# Altium project ESP32_CAM.PrjPcb
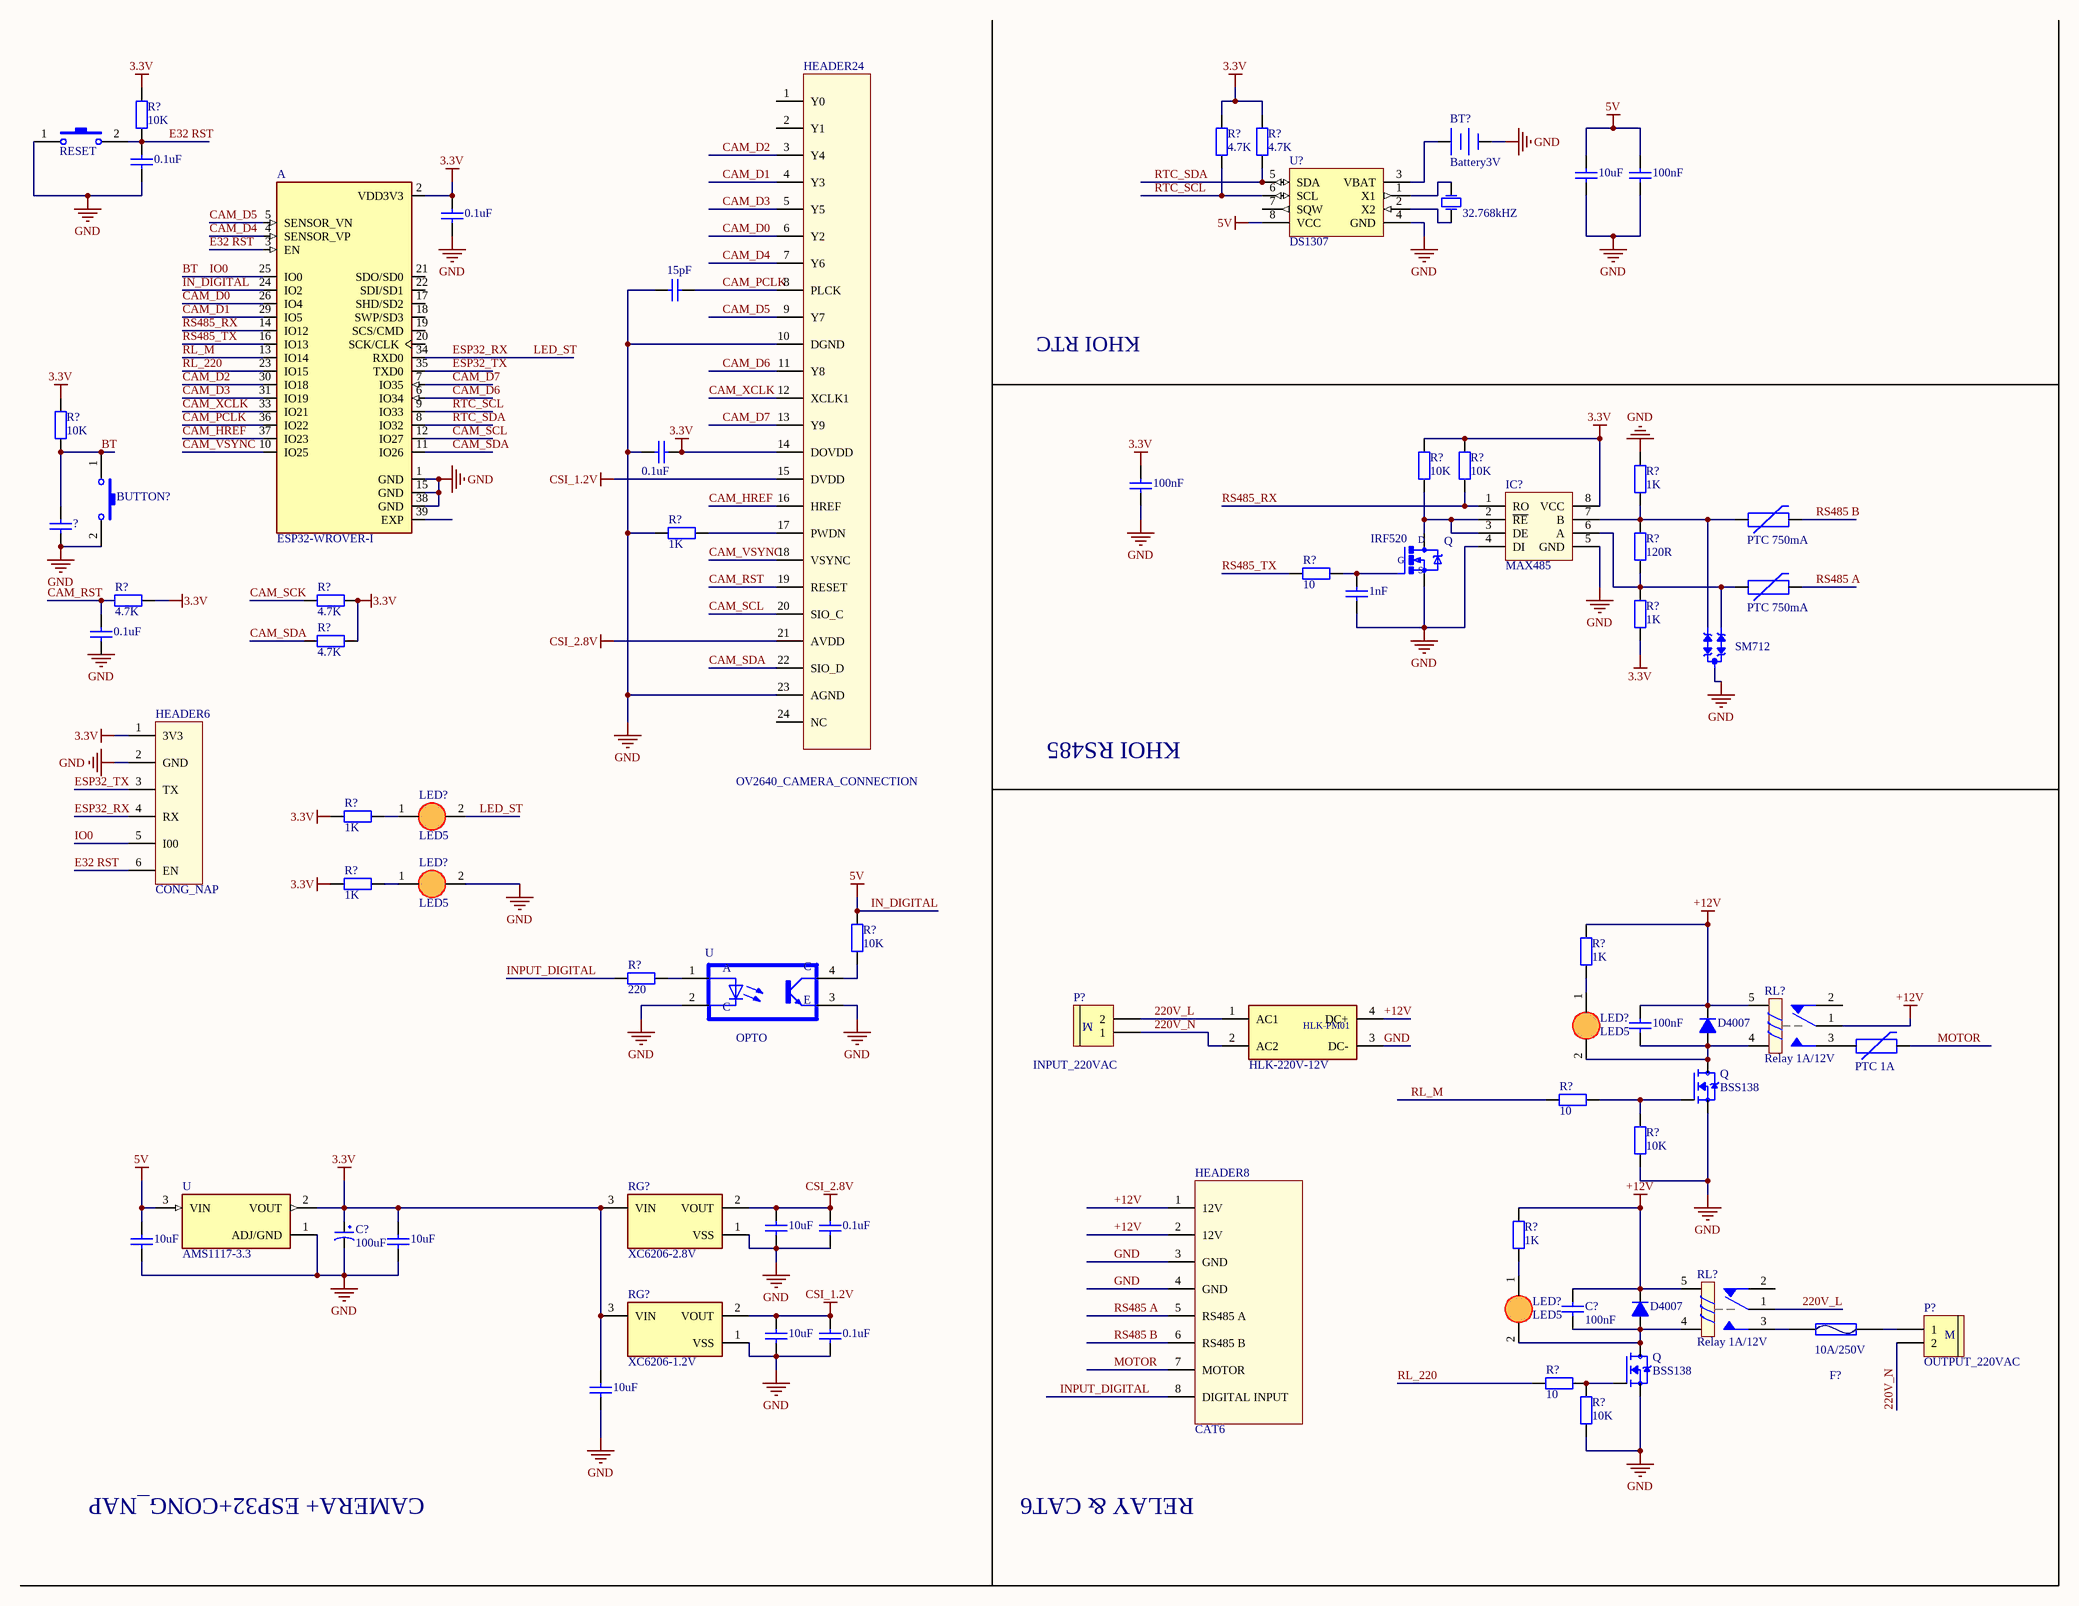
[diagram p0: Sheet1.SchDoc]
1 sheet, 77 parts. Net scope: global (net labels, ports and power ports of the same name join across sheets).
Board file: PCB1.PcbDoc

## Sheet Sheet1.SchDoc
size A0

### Parts
(Parts that share a designator on the sheet are numbered #1, #2 ... from top to bottom, then left to right.)
0.1uF#1  Capacitor Ceramic  [C0805]  (value not drawn)
0.1uF#2  Capacitor Ceramic  [C0805]  (value not drawn)
0.1uF#3  Capacitor Ceramic  [C0805]  (value not drawn)
0.1uF#4  Capacitor Ceramic  [C0805]  (value not drawn)
0.1uF#5  Capacitor Ceramic  [C0805]  (value not drawn)
0.1uF#6  Capacitor Ceramic  [C0805]  (value not drawn)
1nF  Capacitor Ceramic  [C0805]  (value not drawn)
10uF#1  Capacitor Ceramic  [C0805]  (value not drawn)
10uF#2  Capacitor Ceramic  [C0805]  (value not drawn)
10uF#3  Capacitor Ceramic  [C0805]  (value not drawn)
10uF#4  Capacitor Ceramic  [C0805]  (value not drawn)
10uF#5  Capacitor Ceramic  [C0805]  (value not drawn)
10uF#6  Capacitor Ceramic  [C0805]  (value not drawn)
15pF  Capacitor Ceramic  [C0805]  (value not drawn)
100nF#1  Capacitor Ceramic  [C0805]  (value not drawn)
100nF#2  Capacitor Ceramic  [C0805]  (value not drawn)
100nF#3  Capacitor Ceramic  [C0805]  (value not drawn)
?#1  PTC 750mA  [MC331XX]
?#2  Capacitor Ceramic  [C0805]  (value not drawn)
?#3  PTC 750mA  [MC331XX]
?#4  SM712  [SOT23-3]
?#5  HLK-220V-12V  [HLK 220-12]
?#6  PTC 1A  [MC331XX]
A  ESP32-WROVER-I  [XCVR_ESP32-WROVER-I]
BT?  Battery3V  [HDR1X2]
BUTTON?  SW-2P-S  [SW-2P-S]  (value not drawn)
C?#1  100uF  [CP1.5/3.4]
C?#2  100nF  [C1206]
D4007#1  1N4007  [D1A]  (value not drawn)
D4007#2  1N4007  [D1A]  (value not drawn)
F?  10A/250V  [Fuse]
HEADER6  CONG_NAP  [CONG_NAP]
HEADER8  CAT6  [CAT6_3.5mm]
HEADER24  OV2640_CAMERA_CONNECTION  [OV2640_0.5mm]
IC?  MAX485  [SO-8]
LED?#1  LED5  [LED5MM]
LED?#2  LED5  [LED5MM]
LED?#3  LED5  [LED5MM]
LED?#4  LED5  [LED5MM]
P?#1  INPUT_220VAC  [Medium - Header 2]
P?#2  OUTPUT_220VAC  [Medium - Header 2]
Q#1  IRF520  [TO220BV]
Q#2  BSS138  [SOT95P240X111-3N]
Q#3  BSS138  [SOT95P240X111-3N]
R?#1  value 10K  [DIEN TRO 0805]  (hidden comment: RES_08)
R?#2  value 4.7K  [DIEN TRO 0805]  (hidden comment: RES_08)
R?#3  value 4.7K  [DIEN TRO 0805]  (hidden comment: RES_08)
R?#4  value 10K  [DIEN TRO 0805]  (hidden comment: RES_08)
R?#5  value 10K  [DIEN TRO 0805]  (hidden comment: RES_08)
R?#6  value 10K  [DIEN TRO 0805]  (hidden comment: RES_08)
R?#7  value 1K  [DIEN TRO 0805]  (hidden comment: RES_08)
R?#8  value 1K  [DIEN TRO 0805]  (hidden comment: RES_08)
R?#9  value 120R  [DIEN TRO 0805]  (hidden comment: RES_08)
R?#10  value 10  [DIEN TRO 0805]  (hidden comment: RES_08)
R?#11  value 4.7K  [DIEN TRO 0805]  (hidden comment: RES_08)
R?#12  value 4.7K  [DIEN TRO 0805]  (hidden comment: RES_08)
R?#13  value 1K  [DIEN TRO 0805]  (hidden comment: RES_08)
R?#14  value 4.7K  [DIEN TRO 0805]  (hidden comment: RES_08)
R?#15  value 1K  [DIEN TRO 0805]  (hidden comment: RES_08)
R?#16  value 1K  [DIEN TRO 0805]  (hidden comment: RES_08)
R?#17  value 10K  [DIEN TRO 0805]  (hidden comment: RES_08)
R?#18  value 1K  [DIEN TRO 0805]  (hidden comment: RES_08)
R?#19  value 220  [DIEN TRO 0805]  (hidden comment: RES_08)
R?#20  value 10  [DIEN TRO 0805]  (hidden comment: RES_08)
R?#21  value 10K  [DIEN TRO 0805]  (hidden comment: RES_08)
R?#22  value 1K  [DIEN TRO 0805]  (hidden comment: RES_08)
R?#23  value 10  [DIEN TRO 0805]  (hidden comment: RES_08)
R?#24  value 10K  [DIEN TRO 0805]  (hidden comment: RES_08)
RESET  SW-2P-S  [SW-2P-S]  (value not drawn)
RG?#1  Part Number: XC6206-2.8V  [Torex_https--www.torexsemi.com-file-SOT-23-SOT-23-pkg.pdf_0]  (hidden comment: Reg_Torex_XC6206P332MR_eec)
RG?#2  Part Number: XC6206-1.2V  [Torex_https--www.torexsemi.com-file-SOT-23-SOT-23-pkg.pdf_0]  (hidden comment: Reg_Torex_XC6206P332MR_eec)
RL?#1  Relay 1A/12V  [RL_SPDT_10A]
RL?#2  Relay 1A/12V  [RL_SPDT_10A]
U#1  OPTO  [SOIC254P1016X390-4N]
U#2  AMS1117-3.3  [SOT229P700X180-4N]
U?  DS1307  [SOIC8]
Y?  32.768kHZ  [XTAL]

### Nets
3.3V: 0.1uF#2.2 0.1uF#3.1 10uF#4.2 10uF#6.2 100nF#2.2 A.2(VDD3V3) C?#1.1 HEADER6.1(3V3) HEADER24.14(DOVDD) IC?.8(VCC) R?#1.2 R?#2.1 R?#3.1 R?#4.1 R?#5.1 R?#6.1 R?#11.1 R?#12.1 R?#13.2 R?#14.1 R?#15.2 R?#16.2 RG?#1.3(VIN) RG?#2.3(VIN) U#2.2(VOUT)
+12V: 100nF#3.2 ?#5.4(DC+) C?#2.2 D4007#1.2(K) D4007#2.2(K) HEADER8.1(12V) HEADER8.2(12V) R?#18.2 R?#22.2 RL?#1.1 RL?#1.5 RL?#2.5
CSI_1.2V: 0.1uF#6.2 10uF#5.2 HEADER24.15(DVDD) RG?#2.2(VOUT)
CSI_2.8V: 0.1uF#5.2 10uF#2.2 HEADER24.21(AVDD) RG?#1.2(VOUT)
GND: 0.1uF#1.1 0.1uF#2.1 0.1uF#3.2 0.1uF#5.1 0.1uF#6.1 1nF.2 10uF#1.1 10uF#2.1 10uF#3.1 10uF#4.1 10uF#5.1 10uF#6.1 15pF.1 100nF#1.1 100nF#2.1 ?#2.1 ?#4.3(P$3) ?#5.3(DC-) A.1(GND) A.15(GND) A.38(GND) BT?.2(-) BUTTON?.2 C?#1.2 HEADER6.2(GND) HEADER8.3(GND) HEADER8.4(GND) HEADER24.10(DGND) HEADER24.23(AGND) IC?.4(DI) IC?.5(GND) LED?#2.2(K) Q#1.S Q#2.2(S) Q#3.2(S) R?#7.1 R?#8.2 R?#21.2 R?#24.2 RESET.1 RG?#1.1(VSS) RG?#2.1(VSS) U#1.2(C) U#1.3(E) U#2.1(ADJ/GND) U?.4(GND)
IN_DIGITAL: 10uF#1.2 10uF#3.2 100nF#1.2 A.24(IO2) R?#17.1 U#2.3(VIN) U?.8(VCC)  [also labelled 5V]
220V_L: ?#5.1(AC1) P?#1.2 RL?#2.1
220V_N: ?#5.2(AC2) P?#1.1 P?#2.2
BT: ?#2.2 A.25(IO0) BUTTON?.1 HEADER6.5(I00) R?#4.2  [also labelled IO0]
CAM_D0: A.26(IO4) HEADER24.6(Y2)
CAM_D1: A.29(IO5) HEADER24.4(Y3)
CAM_D2: A.30(IO18) HEADER24.3(Y4)
CAM_D3: A.31(IO19) HEADER24.5(Y5)
CAM_D4: A.4(SENSOR_VP) HEADER24.7(Y6)
CAM_D5: A.5(SENSOR_VN) HEADER24.9(Y7)
CAM_D6: A.6(IO34) HEADER24.11(Y8)
CAM_D7: A.7(IO35) HEADER24.13(Y9)
CAM_HREF: A.37(IO23) HEADER24.16(HREF)
CAM_PCLK: 15pF.2 A.36(IO22) HEADER24.8(PLCK)
CAM_RST: 0.1uF#4.2 HEADER24.19(RESET) R?#11.2
CAM_SCK: R?#12.2
CAM_SCL: A.12(IO27) HEADER24.20(SIO_C)
CAM_SDA: A.11(IO26) HEADER24.22(SIO_D) R?#14.2
CAM_VSYNC: A.10(IO25) HEADER24.18(VSYNC)
CAM_XCLK: A.33(IO21) HEADER24.12(XCLK1)
E32 RST: 0.1uF#1.2 A.3(EN) HEADER6.6(EN) R?#1.1 RESET.2
ESP32_RX: A.34(RXD0) HEADER6.4(RX) LED?#1.2(K)  [also labelled LED_ST]
ESP32_TX: A.35(TXD0) HEADER6.3(TX)
INPUT_DIGITAL: HEADER8.8(DIGITAL_INPUT) R?#19.2
MOTOR: ?#6.P$2 HEADER8.7(MOTOR)
RL_220: A.23(IO15) R?#23.1
RL_M: A.13(IO14) R?#20.1
RS485 A: ?#3.P$2 HEADER8.5(RS485_A)
RS485 B: ?#1.P$2 HEADER8.6(RS485_B)
RS485_RX: A.14(IO12) IC?.1(RO) R?#6.2
RS485_TX: A.16(IO13) R?#10.1
RTC_SCL: A.9(IO33) R?#2.2 U?.6(SCL)
RTC_SDA: A.8(IO32) R?#3.2 U?.5(SDA)
Net1nF_1: 1nF.1 Q#1.G R?#10.2
Net100nF#3_1: 100nF#3.1 D4007#1.1(A) LED?#3.2(K) Q#2.3(D) RL?#1.4
Net?#1_P$1: ?#1.P$1 ?#4.2(P$2) IC?.7(B) R?#7.2 R?#9.1
Net?#3_P$1: ?#3.P$1 ?#4.1(P$1) IC?.6(A) R?#9.2 R?#13.1
Net?#6_P$1: ?#6.P$1 RL?#1.3
NetBT?_1: BT?.1(+) U?.3(VBAT)
NetC?#2_1: C?#2.1 D4007#2.1(A) LED?#4.2(K) Q#3.3(D) RL?#2.4
NetF?_1: F?.1 RL?#2.3
NetF?_2: F?.2 P?#2.1
NetHEADER24_17: HEADER24.17(PWDN) R?#8.1
NetIC?_2: IC?.2(~{RE}) IC?.3(DE) Q#1.D R?#5.2
NetLED?#1_1: LED?#1.1(A) R?#15.1
NetLED?#2_1: LED?#2.1(A) R?#16.1
NetLED?#3_1: LED?#3.1(A) R?#18.1
NetLED?#4_1: LED?#4.1(A) R?#22.1
NetQ#2_1: Q#2.1(G) R?#20.2 R?#21.1
NetQ#3_1: Q#3.1(G) R?#23.2 R?#24.1
NetR?#17_2: R?#17.2 U#1.4(CO)
NetR?#19_1: R?#19.1 U#1.1(A)
NetU?_1: U?.1(X1) Y?.2(OSC2)
NetU?_2: U?.2(X2) Y?.1(OSC1)

Not connected (* = marked no-connect by the designer): 0.1uF#4 1; A 17(SHD/SD2) 18(SWP/SD3) 19(SCS/CMD) 20(SCK/CLK) 21(SDO/SD0) 22(SDI/SD1) 39(EXP); HEADER24 1(Y0) 2(Y1) 24(NC); RL?#1 2; RL?#2 2; U? 7(SQW)

### Notes on the sheet
- KHOI RTC
- KHOI RS485
- CAMERA+ ESP32+CONG_NAP
- RELAY & CAT6
- Labels drawn without touching a wire or pin: GND
- Title
- Size:
- Date:
- File:
- A0
- Number:
- Time:
- Revision:
- Sheet
- of
- (in symbol Header 2 - M) M

### Library data of the parts
0.1uF#1-0.1uF#6 1nF 10uF#1-10uF#6 15pF 100nF#1-100nF#3 ?#2 = CapSMD: Capacitor; Value: 33p; Published: 8-Jun-2000; LatestRevisionDate: 17-Jul-2002; LatestRevisionNote: Re-released for DXP Platform.; PackageReference: RAD-0.3; Publisher: Altium Limited
?#1 ?#3 ?#6 = PTC: Polymeric PTC Resettable Fuse 15V 50mA Ih Surface Mount 0603 _1608 Metric_, Concave; MF: NXP Semiconductors; Price: None; Value: *; Package: None; SnapEDA_Link: https://www.snapeda.com/parts/PTC/NXP%20Semiconductors/view-part/570052/?ref=snap; Availability: Unavailable; MP: PTC
?#4 = CDSOT23-SM712: 26V, 14V Clamp 17A _8/20Âµs_ Ipp Tvs Diode Surface Mount SOT-23-3; MF: Bourns; Value: *; SnapEDA_Link: https://www.snapeda.com/parts/CDSOT23-SM712/Bourns%20-%20J.W.%20Miller/view-part/33771/?ref=snap; MP: CDSOT23-SM712; Availability: Unavailable; Price: None; Package: SOT-23 Bourns
?#5 = HLK-PM01: MF: Hi-link; Availability: Unavailable; SnapEDA_Link: https://www.snapeda.com/parts/hlk-pm01/Hi-link/view-part/2875605/?ref=snap; Price: None; Package: Package Analog Devices; MP: hlk-pm01; Value: *
A = ESP32-WROVER-I: Bluetooth, WiFi 802.11b/g/n, Bluetooth v4.2 + EDR, Class 1, 2 and 3 Transceiver Module 2.4GHz ~ 2.5GHz Antenna Not Included, I-PEX Surface Mount; MF: Espressif Systems; Package: Module Espressif Systems; Availability: Unavailable; MP: ESP32-WROVER-I; Value: *; SnapEDA_Link: https://www.snapeda.com/parts/ESP32-WROVER-I/Espressif%20Systems/view-part/2298808/?ref=snap; Price: None
BT? = Battery9V: Multicell Battery; Published: 24-Mar-1999; LatestRevisionDate: 17-Jul-2002; LatestRevisionNote: Re-released for DXP Platform.; PackageReference: BAT-2; Publisher: Altium Limited
BUTTON? RESET = SW-2PIN-SMALL: Switch Small 2 Pin; Published: 24-Mar-1999; LatestRevisionDate: 17-Jul-2002; LatestRevisionNote: Re-released for DXP Platform.; PackageReference: SPST-2; Publisher: Altium Limited
C?#1 = CP3: Cap 100uF/35V - 470uF/16V; Value: 100uF/35V/50V; Description 1: 1000uF/6,3V - 470uF/16V - 330uF - 25V; Description 2: 220uF/35V - 100uF/50V - 63V - 4,7uF/200V; Description 3: 22uF => 33uF100V - 3,3uF => 4,7uF/250V; Description 4: 2,2uF =>3,3uF/350 - 2,2uF/400V - 1uF/450V
C?#2 = Cap SMD 1206
D4007#1 D4007#2 = D1A: Diode 1A; Value: 1N4007
F? = Fuse 1: Fuse; Published: 8-Jun-2000; LatestRevisionDate: 17-Jul-2002; LatestRevisionNote: Re-released for DXP Platform.; PackageReference: PIN-W2/E2.8; Publisher: Altium Limited
HEADER6 = HEADER_6
HEADER24 = OV2640_CAMERA
IC? = MAX485: RS232 - RS485 (Same sn75176)
LED?#1-LED?#4 = LED 5mm
P?#1 P?#2 = Header 2 - M: Header, 2-Pin, Medium; LatestRevisionDate: 17-Jul-2002; LatestRevisionNote: Re-released for DXP Platform.; Publisher: Altium Limited
Q#1 = IRF520: N-Channel 100V 9.2A _Tc_ 60W _Tc_ Through Hole TO-220AB; MF: Vishay Siliconix; MP: IRF520; Availability: Unavailable; Package: TO-220 Vishay Siliconix; Value: *; Price: None; SnapEDA_Link: https://www.snapeda.com/parts/IRF520/Vishay%20Siliconix/view-part/522447/?ref=snap
Q#2 Q#3 = BSS138: N-Channel 50V 220mA (Ta) 360mW (Ta) Surface Mount SOT-23-3; MF: MICROSS/On Semiconductor; DigiKey-Purchase-URL: https://snapeda.com/shop?store=DigiKey&id=2773844; Package: TO-236-3 Micross; Arrow_Electronics-Purchase-URL: https://snapeda.com/shop?store=Arrow+Electronics&id=2773844; Value: *; MP: BSS138; Price: None; SnapEDA_Link: https://www.snapeda.com/parts/BSS138/MICROSS/On%20Semiconductor/view-part/2773844/?ref=snap; Mouser-Purchase-URL: https://snapeda.com/shop?store=Mouser&id=2773844; Availability: Good
RG?#1 RG?#2 = Reg_Torex_XC6206P332MR_eec: Manufacturer: Torex; Voltage: 3.3V; Category 9E07530Daf1645C0: Semiconductors and Actives; Category Bb4C76468Af8608B: Linear Regulators; Accuracy: ±2%; Category 56439B4967F48D84: Power Management; Num Pins: 3; Dropout Voltage: 250mV; Maximum Output Current: 200mA; helpURL: https://upverter.com/upn/revision/d425e2ef490922a5/; ComponentLink2Description: Datasheet; Temperature: -40°C to +85°C; Package: https://www.torexsemi.com/file/SOT-23/SOT-23-pkg.pdf; Supplier 2: Mouser; Supplier 1: Digi-Key; ComponentLink1URL: https://upverter.com/upn/revision/d425e2ef490922a5/; Supplier Part Number 2: 865-XC6206P332MR-G; ComponentLink1Description: Upverter; ComponentLink2URL: https://www.torexsemi.com/file/xc6206/XC6206.pdf; RoHS: TRUE; Mouser Part Number: 865-XC6206P332MR-G; Ipc Land Pattern Name: SOT95P280X110-3; Temperature Range High: +85°C; Temperature Range Low: -40°C; Lead Free: yes; Mfg Package Ident: https://www.torexsemi.com/file/SOT-23/SOT-23-pkg.pdf; Octopart Part Number: e32b2b70e2ce3cec
RL?#1 RL?#2 = Relay 1: Relay SPDT,10A - 12VDC 5 Pin; Value: Relay SPDT, 10A, 12V
U#1 = SFH615A-3X009T: Optoisolator Transistor Output 5300Vrms 1 Channel 4-SMD; MF: Vishay Semiconductor; Value: *; Package: SMD-4 Vishay Semiconductor; MP: SFH615A-3X009T; Price: None; Availability: Unavailable; SnapEDA_Link: https://www.snapeda.com/parts/SFH615A-3X009T/Vishay%20Semiconductor%20Opto%20Division/view-part/697564/?ref=snap
U#2 = AMS1117-3.3: Sot223/Pkg 1-Amp 3.3-Volt Low Drop Out Voltage Regulatator; MF: Advanced Monolithic Systems; Price: None; Package: None; Value: *; MP: AMS1117-3.3; Availability: Unavailable; SnapEDA_Link: https://www.snapeda.com/parts/AMS1117-3.3/Advanced%20Monolithic%20Systems/view-part/53450/?ref=snap
U? = DS1307: Realtime Clock IC; Manufacturer: Maxim; ComponentLink1Description: Digikey Part Link; ComponentLink2Description: Open Datasheet; ComponentLink2URL: H:\LIBRARY\LIBRARY.Datasheet\DS1307.pdf
Y? = XTAL: Crystal Oscillator; Published: 8-Jun-2000; LatestRevisionDate: 17-Jul-2002; LatestRevisionNote: Re-released for DXP Platform.; PackageReference: R38; Publisher: Altium Limited
R?#1-R?#24 = RES_08: Published: 8-Jun-2000; LatestRevisionDate: 17-Jul-2002; LatestRevisionNote: Re-released for DXP Platform.; PackageReference: AXIAL-0.4; Publisher: Altium Limited